# Altium schematic sheet sband.SchDoc
size A
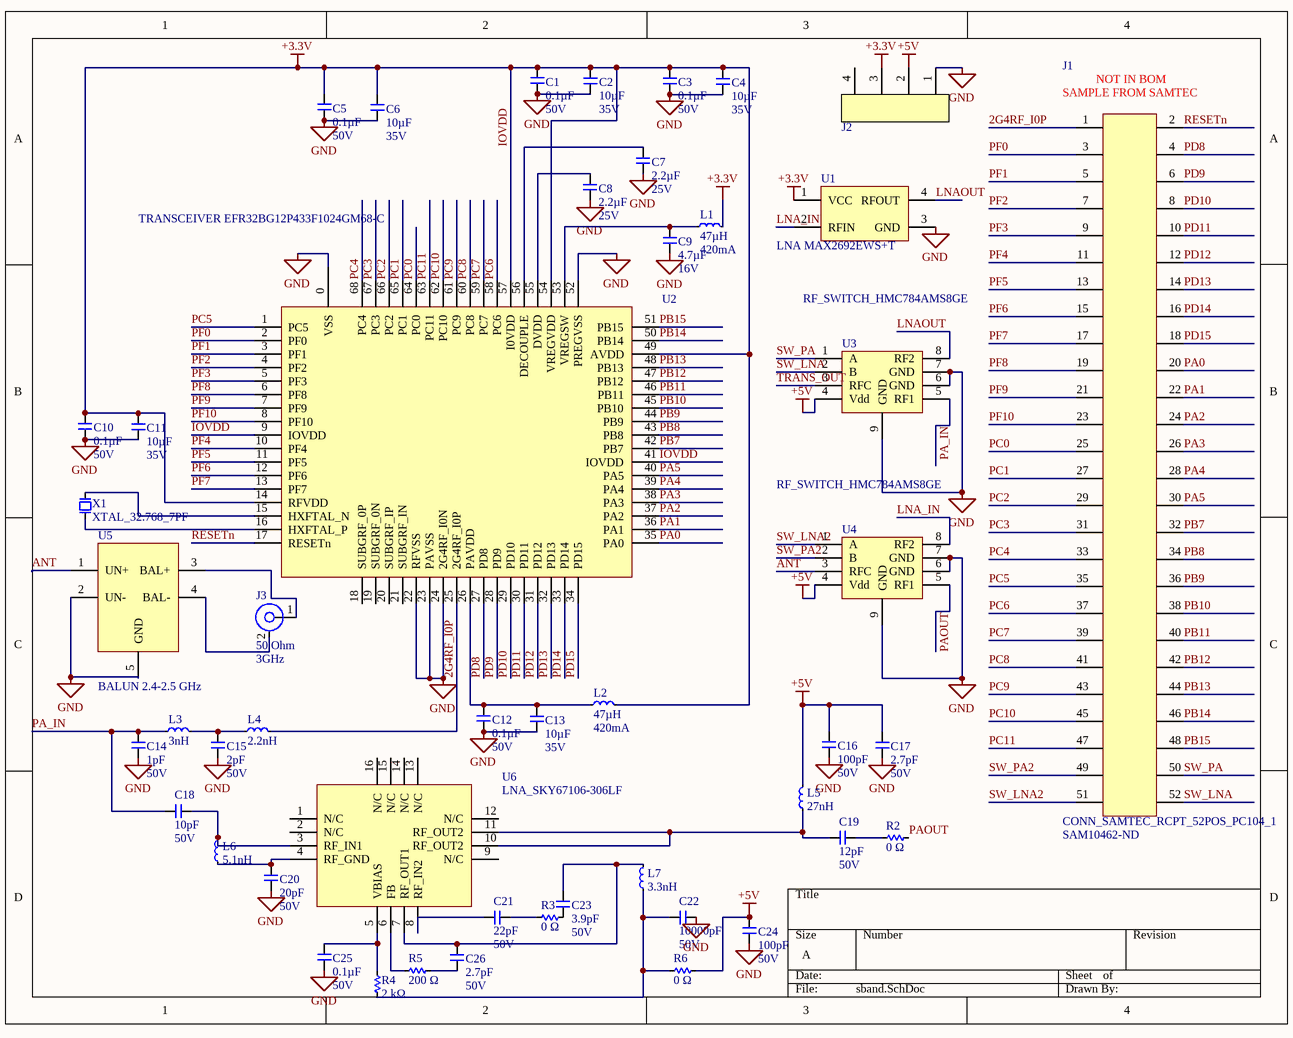
[diagram p0: sband.SchDoc]

## Parts
C1  Capacitance (shorthand): 0.1µF  Rated Voltage: 50V  [C0603]  (hidden comment: __template_cap)
C2  Capacitance (shorthand): 10µF  Rated Voltage: 35V  [C0603]  (hidden comment: __template_cap)
C3  Capacitance (shorthand): 0.1µF  Rated Voltage: 50V  [C0603]  (hidden comment: __template_cap)
C4  Capacitance (shorthand): 10µF  Rated Voltage: 35V  [C0603]  (hidden comment: __template_cap)
C5  Capacitance (shorthand): 0.1µF  Rated Voltage: 50V  [C0603]  (hidden comment: __template_cap)
C6  Capacitance (shorthand): 10µF  Rated Voltage: 35V  [C0603]  (hidden comment: __template_cap)
C7  Capacitance (shorthand): 2.2µF  Rated Voltage: 25V  [C0603]  (hidden comment: __template_cap)
C8  Capacitance (shorthand): 2.2µF  Rated Voltage: 25V  [C0603]  (hidden comment: __template_cap)
C9  Capacitance (shorthand): 4.7µF  Rated Voltage: 16V  [C0603]  (hidden comment: __template_cap)
C10  Capacitance (shorthand): 0.1µF  Rated Voltage: 50V  [C0603]  (hidden comment: __template_cap)
C11  Capacitance (shorthand): 10µF  Rated Voltage: 35V  [C0603]  (hidden comment: __template_cap)
C12  Capacitance (shorthand): 0.1µF  Rated Voltage: 50V  [C0603]  (hidden comment: __template_cap)
C13  Capacitance (shorthand): 10µF  Rated Voltage: 35V  [C0603]  (hidden comment: __template_cap)
C14  Capacitance (shorthand): 1pF  Rated Voltage: 50V  [C0402]  (hidden comment: __template_cap)
C15  Capacitance (shorthand): 2pF  Rated Voltage: 50V  [C0402]  (hidden comment: __template_cap)
C16  Capacitance (shorthand): 100pF  Rated Voltage: 50V  [C0603]  (hidden comment: __template_cap)
C17  Capacitance (shorthand): 2.7pF  Rated Voltage: 50V  [C0402]  (hidden comment: __template_cap)
C18  Capacitance (shorthand): 10pF  Rated Voltage: 50V  [C0402]  (hidden comment: __template_cap)
C19  Capacitance (shorthand): 12pF  Rated Voltage: 50V  [C0603]  (hidden comment: __template_cap)
C20  Capacitance (shorthand): 20pF  Rated Voltage: 50V  [C0402]  (hidden comment: __template_cap)
C21  Capacitance (shorthand): 22pF  Rated Voltage: 50V  [C0603]  (hidden comment: __template_cap)
C22  Capacitance (shorthand): 10000pF  Rated Voltage: 50V  [C0603]  (hidden comment: __template_cap)
C23  Capacitance (shorthand): 3.9pF  Rated Voltage: 50V  [C0402]  (hidden comment: __template_cap)
C24  Capacitance (shorthand): 100pF  Rated Voltage: 50V  [C0603]  (hidden comment: __template_cap)
C25  Capacitance (shorthand): 0.1µF  Rated Voltage: 50V  [C0603]  (hidden comment: __template_cap)
C26  Capacitance (shorthand): 2.7pF  Rated Voltage: 50V  [C0402]  (hidden comment: __template_cap)
J1  CONN_SAMTEC_RCPT_52POS_PC104_1  Supplier Part Number 1: SAM10462-ND  [SAMTEC_ESQ-126-39-G-D]
J2  CONN_1x4_MALE_SMD  [CONN_1x4_100MIL_MALE_SMD]  (value not drawn)
J3  Impedance: 50 Ohm  Frequency - Max: 3GHz  [TE_SMA_JACK_RA_5-1814400-1]  (hidden comment: CONN_SMA_JACK_R/A_50_OHM_PCB)
L1  Inductance: 47µH  Current - Saturation: 420mA  [C1210]  (hidden comment: INDUCTOR 47UH 420MA 1210 SMD)
L2  Inductance: 47µH  Current - Saturation: 420mA  [C1210]  (hidden comment: INDUCTOR 47UH 420MA 1210 SMD)
L3  Inductance: 3nH  [R0402]  (hidden comment: __template_inductor)
L4  Inductance: 2.2nH  [R0402]  (hidden comment: __template_inductor)
L5  Inductance: 27nH  [R0402]  (hidden comment: __template_inductor)
L6  Inductance: 5.1nH  [R0402]  (hidden comment: __template_inductor)
L7  Inductance: 3.3nH  [R0402]  (hidden comment: __template_inductor)
R2  Resistance: 0 Ω  [R0603]  (hidden comment: __template_resistor)
R3  Resistance: 0 Ω  [R0603]  (hidden comment: __template_resistor)
R4  Resistance: 2 kΩ  [R0603]  (hidden comment: __template_resistor)
R5  Resistance: 200 Ω  [R0603]  (hidden comment: __template_resistor)
R6  Resistance: 0 Ω  [R0603]  (hidden comment: __template_resistor)
U1  LNA MAX2692EWS+T  [4WLP]
U2  TRANSCEIVER EFR32BG12P433F1024GM68-C  [68QFN]
U3  RF_SWITCH_HMC784AMS8GE  [8MSOP65E]
U4  RF_SWITCH_HMC784AMS8GE  [8MSOP65E]
U5  BALUN 2.4-2.5 GHz  [2450BL15B200]
U6  LNA_SKY67106-306LF  [16QFN]
X1  XTAL_32.768_7PF  [XTAL_ECS-0.327-7-34B-TR]

## Nets
+5V: C16.1 C17.1 C24.1 J2.2 L5.2 R6.2 U3.4(Vdd) U4.4(Vdd)
GND: C1.2 C2.2 C3.2 C4.2 C5.2 C6.2 C7.2 C8.2 C9.2 C10.2 C11.2 C12.2 C13.2 C14.2 C15.2 C16.2 C17.2 C20.2 C22.2 C24.2 C25.2 J2.1 U1.3(GND) U2.0(VSS) U2.22(RFVSS) U2.23(PAVSS) U2.24(2G4RF_I0N) U2.52(PREGVSS) U3.6(GND) U3.7(GND) U3.9(GND) U4.6(GND) U4.7(GND) U4.9(GND) U5.2(UN-) U5.5(GND)
IOVDD: C1.1 C2.1 C3.1 C4.1 C5.1 C6.1 C10.1 C11.1 J2.3 L1.1 L2.1 U1.1(VCC) U2.9(IOVDD) U2.14(RFVDD) U2.41(IOVDD) U2.49(AVDD) U2.54(VREGVDD) U2.57(I0VDD)  [also labelled +3.3V]
2G4RF_I0P: J1.1 L4.2 U2.25(2G4RF_I0P)
ANT: U4.3(RFC) U5.1(UN+)
LNA_IN: U1.2(RFIN) U4.8(RF2)
LNAOUT: U1.4(RFOUT) U3.8(RF2)
PA0: J1.20 U2.35(PA0)
PA1: J1.22 U2.36(PA1)
PA2: J1.24 U2.37(PA2)
PA3: J1.26 U2.38(PA3)
PA4: J1.28 U2.39(PA4)
PA5: J1.30 U2.40(PA5)
PA_IN: C14.1 C18.1 L3.1 U3.5(RF1)
PAOUT: R2.2 U4.5(RF1)
PB7: J1.32 U2.42(PB7)
PB8: J1.34 U2.43(PB8)
PB9: J1.36 U2.44(PB9)
PB10: J1.38 U2.45(PB10)
PB11: J1.40 U2.46(PB11)
PB12: J1.42 U2.47(PB12)
PB13: J1.44 U2.48(PB13)
PB14: J1.46 U2.50(PB14)
PB15: J1.48 U2.51(PB15)
PC0: J1.25 U2.64(PC0)
PC1: J1.27 U2.65(PC1)
PC2: J1.29 U2.66(PC2)
PC3: J1.31 U2.67(PC3)
PC4: J1.33 U2.68(PC4)
PC5: J1.35 U2.1(PC5)
PC6: J1.37 U2.58(PC6)
PC7: J1.39 U2.59(PC7)
PC8: J1.41 U2.60(PC8)
PC9: J1.43 U2.61(PC9)
PC10: J1.45 U2.62(PC10)
PC11: J1.47 U2.63(PC11)
PD8: J1.4 U2.27(PD8)
PD9: J1.6 U2.28(PD9)
PD10: J1.8 U2.29(PD10)
PD11: J1.10 U2.30(PD11)
PD12: J1.12 U2.31(PD12)
PD13: J1.14 U2.32(PD13)
PD14: J1.16 U2.33(PD14)
PD15: J1.18 U2.34(PD15)
PF0: J1.3 U2.2(PF0)
PF1: J1.5 U2.3(PF1)
PF2: J1.7 U2.4(PF2)
PF3: J1.9 U2.5(PF3)
PF4: J1.11 U2.10(PF4)
PF5: J1.13 U2.11(PF5)
PF6: J1.15 U2.12(PF6)
PF7: J1.17 U2.13(PF7)
PF8: J1.19 U2.6(PF8)
PF9: J1.21 U2.7(PF9)
PF10: J1.23 U2.8(PF10)
RESETn: J1.2 U2.17(RESETn)
SW_LNA: J1.52 U3.2(B)
SW_LNA2: J1.51 U4.1(A)
SW_PA: J1.50 U3.1(A)
SW_PA2: J1.49 U4.2(B)
TRANS_OUT: U3.3(RFC)
NetC7_1: C7.1 U2.56(DECOUPLE)
NetC8_1: C8.1 U2.55(DVDD)
NetC9_1: C9.1 L1.2 U2.53(VREGSW)
NetC12_1: C12.1 C13.1 L2.2 U2.26(PAVDD)
NetC15_1: C15.1 L3.2 L4.1
NetC18_2: C18.2 L6.2 U6.3(RF_IN1)
NetC19_1: C19.1 L5.1 U6.10(RF_OUT2) U6.11(RF_OUT2)
NetC19_2: C19.2 R2.1
NetC20_1: C20.1 L6.1 U6.4(RF_GND)
NetC21_1: C21.1 U6.8(RF_IN2)
NetC21_2: C21.2 R3.1
NetC22_1: C22.1 L7.1 R4.1 R6.1
NetC23_1: C23.1 R3.2
NetC23_2: C23.2 C26.1 L7.2 U6.7(RF_OUT1)
NetC25_1: C25.1 R4.2 U6.5(VBIAS)
NetC26_2: C26.2 R5.2
NetJ3_1: J3.1 U5.3(BAL+)
NetJ3_2: J3.2 U5.4(BAL-)
NetR5_1: R5.1 U6.6(FB)
NetU2_15: U2.15(HXFTAL_N) X1.1
NetU2_16: U2.16(HXFTAL_P) X1.2

Not connected (* = marked no-connect by the designer): J2 4; U2 18(SUBGRF_0P) 19(SUBGRF_0N) 20(SUBGRF_IP) 21(SUBGRF_IN); U6 1(N/C) 2(N/C) 9(N/C) 12(N/C) 13(N/C) 14(N/C) 15(_N/C) 16(N/C)

## Notes on the sheet
- (in symbol CONN_SAMTEC_RCPT_52POS_PC104_1) NOT IN BOM; SAMPLE FROM SAMTEC

## Library data of the parts
C1 C3 C5 C10 C12 C25 = 490-1519-1-ND: CAP CER 0603 0.1µF X7R 50V 10%; Manufacturer: Murata Electronics North America; Capacitance - pF (Machine readable): #NAME?; type: capacitor; Supplier Part Number 1: 490-1519-1-ND; Dielectric: X7R; Supplier 1: Digikey
C2 C4 C6 C11 C13 = 490-13248-1-ND: CAP CER 10UF 35V X5R 0603 20%; Manufacturer: Murata Electronics North America; Capacitance - pF (Machine readable): #NAME?; type: capacitor; Supplier Part Number 1: 490-13248-1-ND; Dielectric: X5R; Supplier 1: Digikey
C7 C8 = 490-10731-1-ND: CAP CER 2.2UF 16V X5R 0603 10%; Manufacturer: Murata Electronics North America; Capacitance - pF (Machine readable): #NAME?; type: capacitor; Supplier Part Number 1: 490-10731-1-ND; Dielectric: X5R; Supplier 1: Digikey
C9 = 311-1785-1-ND: CAP CER 4.7UF 16V X5R 0603 10%; Manufacturer: Yageo; Capacitance - pF (Machine readable): #NAME?; type: capacitor; Supplier Part Number 1: 311-1785-1-ND; Dielectric: X5R; Supplier 1: Digikey
C14 = 490-6073-1-ND: CAP CER 1PF 50V C0G/NP0 0402; Manufacturer: Murata Electronics North America; Capacitance - pF (Machine readable): 1; type: capacitor; Dielectric: C0G, NP0; Tolerance: ±0.1pF; Supplier Part Number 1: 490-6073-1-ND; Supplier 1: Digikey
C15 = 490-8091-1-ND: CAP CER 2PF 50V C0G/NP0 0402; Manufacturer: Murata Electronics North America; Capacitance - pF (Machine readable): 2; type: capacitor; Dielectric: C0G, NP0; Tolerance: ±0.1pF; Supplier Part Number 1: 490-8091-1-ND; Supplier 1: Digikey
C16 C24 = 490-1427-1-ND: CAP CER 100PF 50V C0G/NP0 0603; Manufacturer: Murata Electronics North America; Capacitance - pF (Machine readable): 100; type: capacitor; Dielectric: C0G, NP0; Supplier Part Number 1: 490-1427-1-ND; Supplier 1: Digikey
C17 C26 = 490-8094-1-ND: CAP CER 2.7PF 50V C0G/NP0 0402; Manufacturer: Murata Electronics North America; Capacitance - pF (Machine readable): 2.7; type: capacitor; Dielectric: C0G, NP0; Tolerance: ±0.1pF; Supplier Part Number 1: 490-8094-1-ND; Supplier 1: Digikey
C18 = 490-11189-1-ND: CAP CER 10PF 50V C0G/NP0 0402; Manufacturer: Murata Electronics North America; Capacitance - pF (Machine readable): 10; type: capacitor; Dielectric: C0G, NP0; Tolerance: ±1%; Supplier Part Number 1: 490-11189-1-ND; Supplier 1: Digikey
C19 = 490-1405-1-ND: CAP CER 12PF 50V C0G/NP0 0603; Manufacturer: Murata Electronics North America; Capacitance - pF (Machine readable): 12; type: capacitor; Dielectric: C0G, NP0; Supplier Part Number 1: 490-1405-1-ND; Supplier 1: Digikey
C20 = 490-8090-1-ND: CAP CER 20PF 50V C0G/NP0 0402; Manufacturer: Murata Electronics North America; Capacitance - pF (Machine readable): 20; type: capacitor; Dielectric: C0G, NP0; Tolerance: ±2%; Supplier Part Number 1: 490-8090-1-ND; Supplier 1: Digikey
C21 = 490-1411-1-ND: CAP CER 22PF 50V C0G/NP0 0603; Manufacturer: Murata Electronics North America; Capacitance - pF (Machine readable): 22; type: capacitor; Dielectric: C0G, NP0; Supplier Part Number 1: 490-1411-1-ND; Supplier 1: Digikey
C22 = 490-1512-1-ND: CAP CER 0603 10000pF X7R 50V 10%; Manufacturer: Murata Electronics North America; Capacitance - pF (Machine readable): #NAME?; type: capacitor; Supplier Part Number 1: 490-1512-1-ND; Dielectric: X7R; Supplier 1: Digikey
C23 = 490-8099-1-ND: CAP CER 3.9PF 50V C0G/NP0 0402; Manufacturer: Murata Electronics North America; Capacitance - pF (Machine readable): 3.9; type: capacitor; Dielectric: C0G, NP0; Tolerance: ±0.1pF; Supplier Part Number 1: 490-8099-1-ND; Supplier 1: Digikey
J1 = CONN_SAMTEC_RCPT_52POS_PC104_1: CONN RCPT 52POS .100" DUAL GOLD; Manufacturer: Samtec Inc.; Manufacturer Part Number: ESQ-126-39-G-D; Connector Type: Elevated Socket; Style: Board to Board; Number of Positions: 52; Number of Positions Loaded: All; Pitch - Mating: 0.100" (2.54mm); Contact Length - Post: 0.480" (12.19mm); Material Flammability Rating: UL94 V-0; Current Rating: 5.7A per Contact; Voltage Rating: 550VAC; Supplier 1: Digi-Key; RoHS: RoHS Compliant; Category: Connectors, Interconnects; Stock 1: 21; Pricing 1: 1=9.01, 10=8.48, 25=8.2416, 50=7.685, 100=7.42, 250=6.89, 500=6.7575, 1000=6.4925, 2500=6.36 (USD); Packaging: Tube; Part Status: Active; Contact Type: Forked; Number of Rows: 2; Row Spacing - Mating: 0.100" (2.54mm); Mounting Type: Through Hole; Termination: Solder; Fastening Type: Push-Pull; Contact Finish - Mating: Gold; Contact Finish Thickness - Mating: 20µin (0.51µm); Insulation Color: Black; Insulation Height: 0.435" (11.05mm); Operating Temperature: -55°C ~ 125°C; Contact Finish - Post: Gold; Mated Stacking Heights: -; Ingress Protection: -; Features: -; Applications: -; Insulation Material: Liquid Crystal Polymer (LCP); Contact Shape: Square; Contact Material: Phosphor Bronze; Contact Finish Thickness - Post: 3µin (0.08µm); ComponentLink1URL: http://suddendocs.samtec.com/prints/esq-1xx-xx-x-x-xxx-xx-x-xx-mkt.pdf; ComponentLink1Description: http://suddendocs.samtec.com/prints/esq-1xx-xx-x-x-xxx-xx-x-xx-mkt.pdf
J2 = CMP-029-0037-1: CONN HEADER 4POS MALE SMD; Manufacturer: 3M; Manufacturer Part Number: 961104-6700-AR-TP; Pitch: 0.100" (2.54mm); Connector Type: Header, Unshrouded; Number of Positions Loaded: All; Number of Positions: 4; Packaging: Tube; Stock 1: 6022; Color: Black; Part Status: Active; Contact Type: Male Pin; Features: -; Contact Finish Thickness: Flash; Contact Finish: Gold; Contact Mating Length: 0.260" (6.60mm); Mounting Type: Surface Mount; Fastening Type: -; Row Spacing: -; ComponentLink1URL: http://multimedia.3m.com/mws/media/548111O/3mtm-pin-strip-header-ts2183.pdf; Design Item ID: CONN_1x4_MALE_SMD; RoHS: RoHS Compliant; Pricing 1: 1=0.64, 10=0.6, 25=0.54, 50=0.48, 100=0.46, 250=0.42, 500=0.4, 1000=0.33, 2500=0.3 (USD); Number of Rows: 1; ComponentLink1Description: http://multimedia.3m.com/mws/media/548111O/3mtm-pin-strip-header-ts2183.pdf; Source: connector.SchLib; Termination: Solder
J3 = CMP-029-0089-1: CONN SMA JACK R/A 50 OHM PCB; Manufacturer: TE Connectivity; Manufacturer Part Number: 5-1814400-1; Contact Termination: Solder; Body Finish: Gold; Center Contact Material: Beryllium Copper; Body Material: Zinc Alloy; Connector Type: Jack, Female Socket; Dielectric Material: Polytetrafluoroethylene (PTFE); Connector Style: SMA; Shield Termination: Solder; ComponentLink1Description: Datasheet; Features: -; Source: connector.SchLib; Fastening Type: Threaded; RoHS: RoHS Compliant; Packaging: Bulk; Operating Temperature: -; Design Item ID: CONN_SMA_JACK_R/A_50_OHM_PCB; Ingress Protection: -; Pricing 1: 1=3.33, 10=3.192, 25=2.926, 50=2.793, 100=2.66, 250=2.32752, 500=2.261, 1000=1.9285, 2500=1.7955 (USD); Voltage Rating: -; Mounting Type: Through Hole, Right Angle; Housing Color: -; Cable Group: -; Center Contact Plating: Gold; Stock 1: 20752; ComponentLink1URL: http://www.te.com/commerce/DocumentDelivery/DDEController?Action=srchrtrv&DocNm=1814400&DocType=Customer+Drawing&DocLang=English
L1 L2 = IND_BRL3225T470K: Manufacturer: Taiyo Yuden; Current: 390mA; Tolerance: ±10%; Shielding: Unshielded; DC Resistance (DCR): 1.2 Ohm Max; Frequency - Self Resonant: 7MHz; Frequency - Test: 100kHz; Supplier 1: Digi-Key; Manufacturer Part Number: BRL3225T470K; RoHS: RoHS Compliant; Category: Inductors, Coils, Chokes; Stock 1: 3308; Pricing 1: 1=0.16, 10=0.155, 50=0.145, 100=0.1354, 500=0.10638, 1000=0.08704 (GBP); Current - Temperature Rise: 390mA; Type: -; Q @ Freq: -; Applications: Power Supplies; Material - Core: -; Package / Case: 1210 (3225 Metric); Mounting Type: Surface Mount; Packaging: Cut Tape (CT); Operating Temperature: -40°C ~ 105°C; ComponentLink1URL: http://www.yuden.co.jp/ut/product/pdf/wound07_e.pdf; ComponentLink1Description: Datasheet; Supplier Part Number 1: 587-2169-1-ND
L3 = 490-14712-1-ND: FIXED IND 3NH 1.35A 63 MOHM SMD; Manufacturer: Murata Electronics North America; Inductance - nH (Machine readable): 3; Frequency - Self Resonant: 12.5GHz; Supplier Part Number 1: 490-14712-1-ND; type: inductor; Current Rating: 1.35A; Supplier 1: Digikey
L4 = 490-15378-1-ND: FIXED IND 2.2NH 2.53A 22 MOHM; Manufacturer: Murata Electronics North America; Inductance - nH (Machine readable): 2.2; Frequency - Self Resonant: 15.5GHz; Supplier Part Number 1: 490-15378-1-ND; type: inductor; Current Rating: 2.53A; Supplier 1: Digikey
L5 = 490-15373-1-ND: FIXED IND 27NH 680MA 288 MOHM; Manufacturer: Murata Electronics North America; Inductance - nH (Machine readable): 27; Frequency - Self Resonant: 4GHz; Supplier Part Number 1: 490-15373-1-ND; type: inductor; Current Rating: 680mA; Supplier 1: Digikey
L6 = 490-16889-1-ND: FIXED IND 5.1NH 1.77A 40 MOHM; Manufacturer: Murata Electronics North America; Inductance - nH (Machine readable): 5.1; Frequency - Self Resonant: 8GHz; Supplier Part Number 1: 490-16889-1-ND; type: inductor; Current Rating: 1.77A; Supplier 1: Digikey
L7 = 490-7641-1-ND: FIXED IND 3.3NH 2A 30 MOHM SMD; Manufacturer: Murata Electronics North America; Inductance - nH (Machine readable): 3.3; Frequency - Self Resonant: 14GHz; Supplier Part Number 1: 490-7641-1-ND; type: inductor; Current Rating: 2A; Supplier 1: Digikey
R2 R3 R6 = 311-0.0HRCT-ND: RES SMD 0 OHM JUMPER 1/10W 0603; Manufacturer Part Number: RC0603FR-070RL; Manufacturer: Yageo; Resistance (Sortable): 0; Power (Watts): 0.1W, 1/10W; Supplier Part Number 1: 311-0.0HRCT-ND; Supplier 1: Digikey; Datasheets: http://www.yageo.com/documents/recent/PYu-RC_Group_51_RoHS_L_9.pdf; Image: //media.digikey.com/Renders/Yageo%20Renders/0603-(1608-Metric).jpg; Tolerance: Jumper; Temperature Coefficient: -; Operating Temperature: -55°C ~ 155°C
R4 = 311-2.00KHRCT-ND: RES SMD 2K OHM 1% 1/10W 0603; Manufacturer Part Number: RC0603FR-072KL; Manufacturer: Yageo; Resistance (Sortable): 2000; Power (Watts): 0.1W, 1/10W; Temperature Coefficient: ±100ppm/°C; Supplier Part Number 1: 311-2.00KHRCT-ND; Supplier 1: Digikey; Datasheets: http://www.yageo.com/documents/recent/PYu-RC_Group_51_RoHS_L_9.pdf; Image: //media.digikey.com/Renders/Yageo%20Renders/0603-(1608-Metric).jpg; Tolerance: ±1%; Operating Temperature: -55°C ~ 155°C
R5 = 311-200HRCT-ND: RES SMD 200 OHM 1% 1/10W 0603; Manufacturer Part Number: RC0603FR-07200RL; Manufacturer: Yageo; Resistance (Sortable): 200; Power (Watts): 0.1W, 1/10W; Temperature Coefficient: ±100ppm/°C; Supplier Part Number 1: 311-200HRCT-ND; Supplier 1: Digikey; Datasheets: http://www.yageo.com/documents/recent/PYu-RC_Group_51_RoHS_L_9.pdf; Image: //media.digikey.com/Renders/Yageo%20Renders/0603-(1608-Metric).jpg; Tolerance: ±1%; Operating Temperature: -55°C ~ 155°C
U5 = BALUN_2450BL15B200E: Manufacturer: Johanson; Impedance: 200R; Frequency: 2.45GHz; Insertion Loss: 1dB; Max Frequency: 2.5GHz; Return Loss: 9.5dB; ComponentLink1URL: https://www.johansontechnology.com/datasheets/baluns/2450FM07A0029.pdf; ComponentLink1Description: https://www.johansontechnology.com/datasheets/baluns/2450FM07A0029.pdf; Supplier 1: Digi-Key; Manufacturer Part Number: 2450BL15B200E; Stock 1: 184167; Pricing 1: 1=0.36, 10=0.356, 25=0.238, 50=0.212, 100=0.1942, 250=0.1742, 500=0.1706, 1000=0.1234 (USD); Mount: Surface Mount; Case/Package: 0805; Case Code (Metric): 2012; Case Code (Imperial): 0805; Min Operating Temperature: -40°C; Max Operating Temperature: 85°C; Packaging: Tape and Reel; Package Quantity: 4000; Termination: SMD/SMT; Composition: Ceramic; REACH SVHC: No SVHC; ComponentLink2URL: https://datasheet.ciiva.com/1428/87148-1428640.pdf; ComponentLink2Description: https://datasheet.ciiva.com/1428/87148-1428640.pdf; ComponentLink3URL: https://datasheet.ciiva.com/24025/balun-2450bl15b200-242390-24025840.pdf; ComponentLink3Description: https://datasheet.ciiva.com/24025/balun-2450bl15b200-242390-24025840.pdf; ComponentLink4URL: https://datasheet.ciiva.com/1376/87148-1376071.pdf; ComponentLink4Description: https://datasheet.ciiva.com/1376/87148-1376071.pdf; ComponentLink5URL: https://datasheet.ciiva.com/2788/jti-balun-2450bl15b200-12-03-2788727.pdf; ComponentLink5Description: https://datasheet.ciiva.com/2788/jti-balun-2450bl15b200-12-03-2788727.pdf; ComponentLink6URL: https://datasheet.ciiva.com/2788/jti-balun-2450bl15b200-12-03-2788728.pdf; ComponentLink6Description: https://datasheet.ciiva.com/2788/jti-balun-2450bl15b200-12-03-2788728.pdf; ComponentLink7URL: https://datasheet.ciiva.com/2788/jti-balun-2450bl15b200-12-03-2788729.pdf; ComponentLink7Description: https://datasheet.ciiva.com/2788/jti-balun-2450bl15b200-12-03-2788729.pdf; Supplier Part Number 1: 712-1043-1-ND
U6 = LNA_SKY67106-306LF: TWO-STAGE LNA
X1 = XTAL_32.768_7PF: CRYSTAL 32.7680KHZ 7PF SMD; Manufacturer: ECS International; Manufacturer Part Number: ECS-.327-7-34B-TR; Frequency: 32.768kHz; Frequency Tolerance: 20ppm; ESR (Equivalent Series Resistance): 70kR; Supplier 1: Digi-Key; Stock 1: 164631; Pricing 1: 1=0.69, 10=0.578, 50=0.5198, 100=0.462, 500=0.4389, 1000=0.3696 (USD); Mount: Surface Mount; Case/Package: SMD/SMT; Number of Pins: 2; Min Operating Temperature: -40°C; Max Operating Temperature: 85°C; Package Quantity: 1; Load Capacitance: 7pF; Packaging: Tape and Reel; Tolerance: 20ppm; Termination: SMD/SMT; Length: 0.126inch; Height: 0.035inch; Width: 0.059inch; Lead Free: Lead Free; ComponentLink1URL: http://www.ecsxtal.com/store/pdf/partnumber4.pdf; ComponentLink1Description: http://www.ecsxtal.com/store/pdf/partnumber4.pdf; Supplier Part Number 1: XC1656DKR-ND